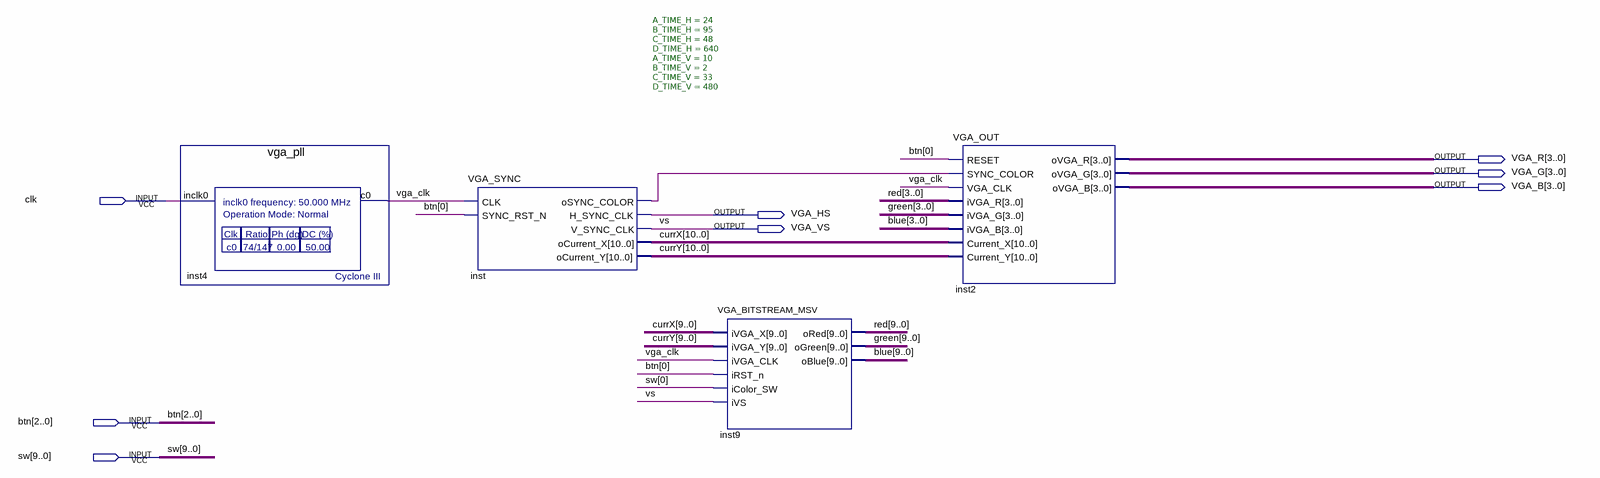
[diagram p0: schematic sheet]
// Quartus schematic vga_test.bdf as structural Verilog: 4 symbols, 8 pins
module vga_test (
  input  clk,
  input  [2:0] btn,
  input  [9:0] sw,
  output [3:0] VGA_R,
  output [3:0] VGA_G,
  output [3:0] VGA_B,
  output VGA_HS,
  output VGA_VS
);

  wire inst_osync_color, vga_clk;
  wire [9:0] blue, green, red;
  wire [10:0] currX, currY;

  vga_pll inst4 (.inclk0(clk), .c0(vga_clk));
  VGA_SYNC #(.A_TIME_H(24), .B_TIME_H(95), .C_TIME_H(48), .D_TIME_H(640), .A_TIME_V(10), .B_TIME_V(2), .C_TIME_V(33), .D_TIME_V(480)) inst (
    .CLK(vga_clk), .SYNC_RST_N(btn[0]), .oSYNC_COLOR(inst_osync_color), .H_SYNC_CLK(VGA_HS),
    .V_SYNC_CLK(VGA_VS), .oCurrent_X(currX), .oCurrent_Y(currY));
  VGA_BITSTREAM_MSV inst9 (
    .iVGA_X(currX[9:0]), .iVGA_Y(currY[9:0]), .iVGA_CLK(vga_clk), .iRST_n(btn[0]), .iColor_SW(sw[0]),
    .iVS(VGA_VS), .oRed(red), .oGreen(green), .oBlue(blue));
  VGA_OUT inst2 (
    .RESET(btn[0]), .SYNC_COLOR(inst_osync_color), .VGA_CLK(vga_clk), .iVGA_R(red[3:0]), .iVGA_G(green[3:0]),
    .iVGA_B(blue[3:0]), .Current_X(currX), .Current_Y(currY), .oVGA_R(VGA_R), .oVGA_G(VGA_G), .oVGA_B(VGA_B));

  // Other names for the same wires on the sheet: vs = VGA_VS
endmodule
